# EAGLE design boron-programmer (EAGLE 8.3.2)
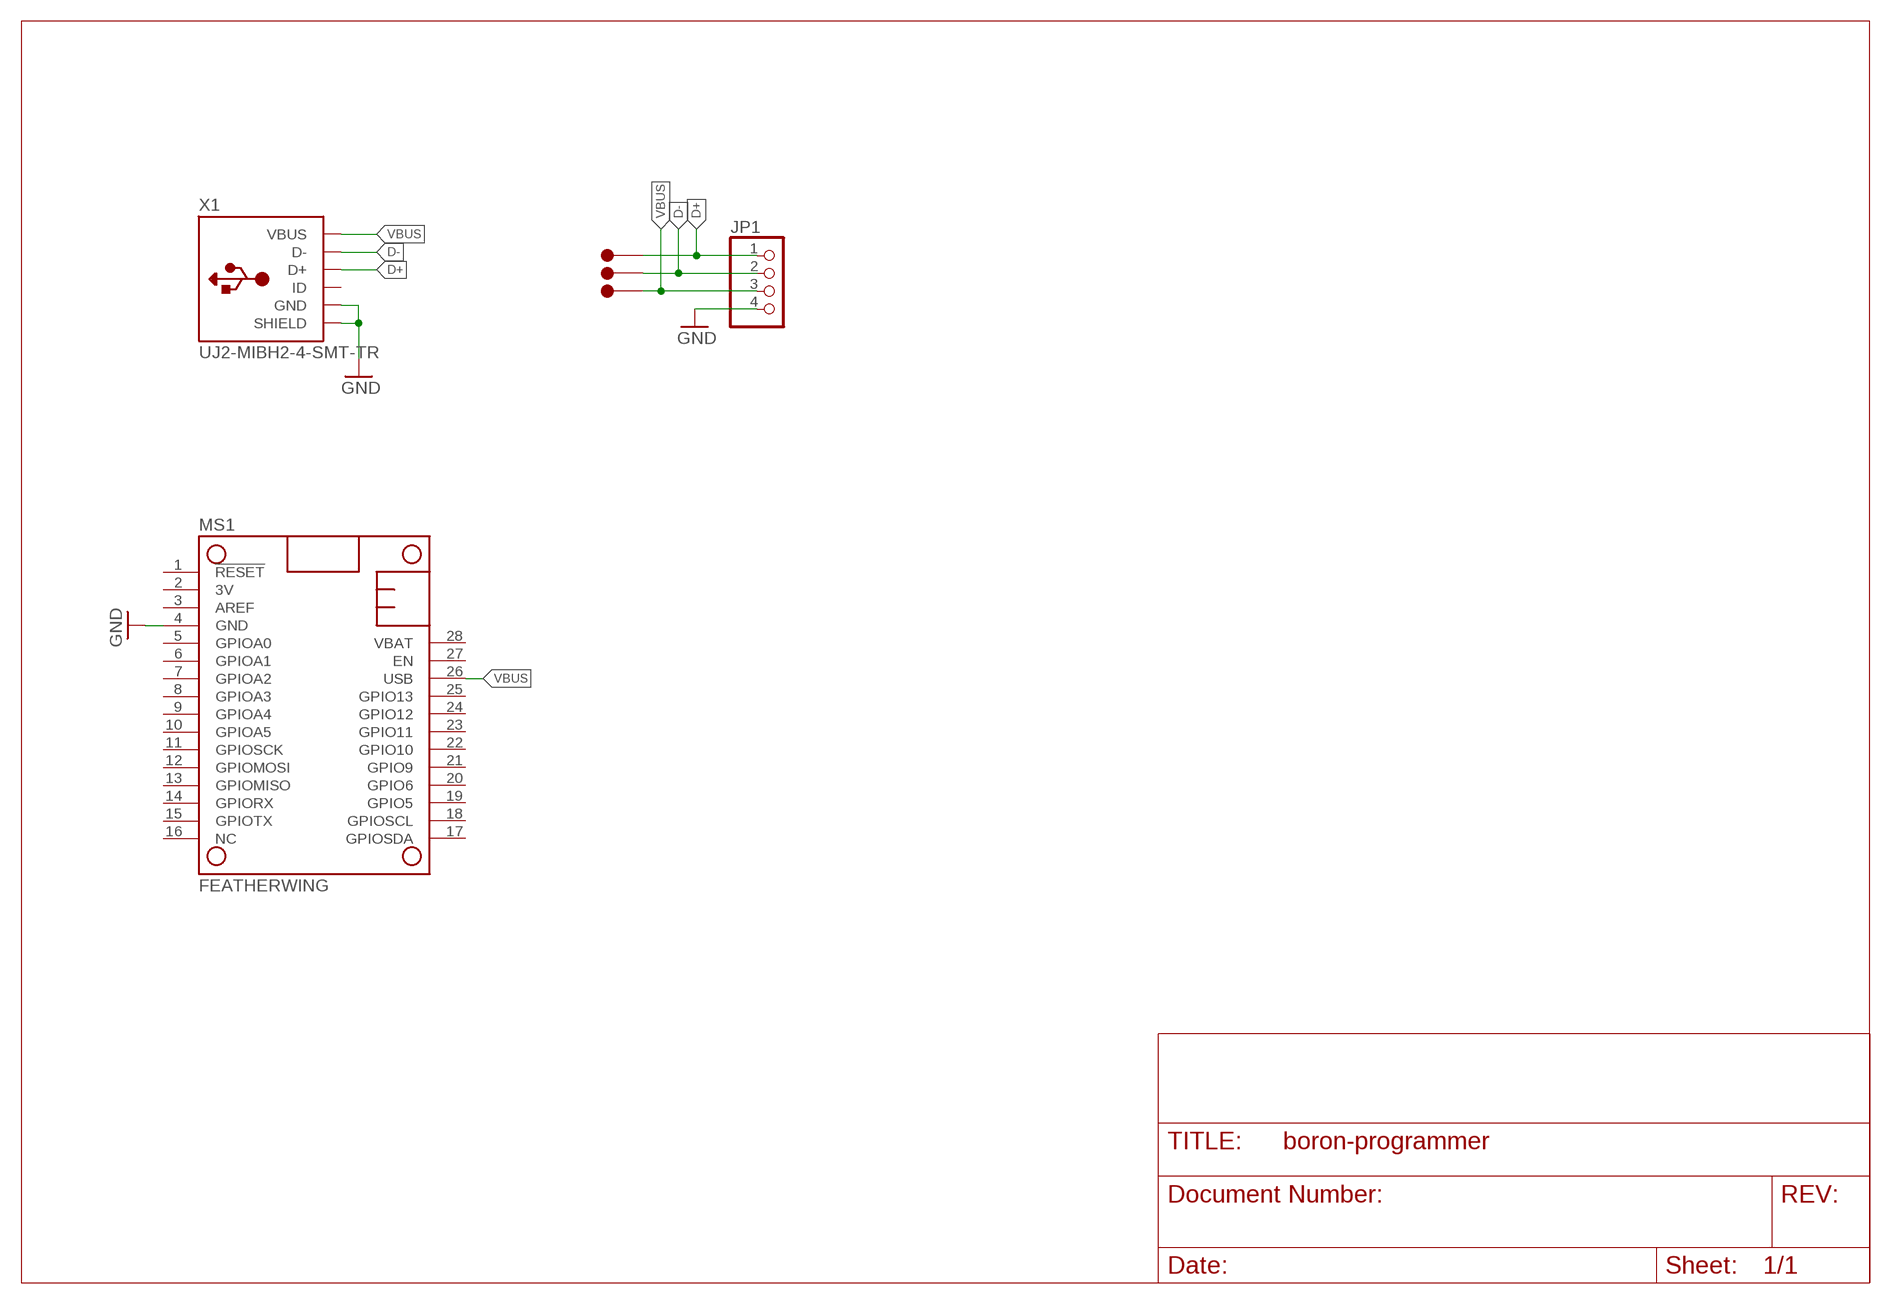
[diagram p0: schematic, sheet 1]

## Parts
C1  POGO_PIN_1MM  [POGO_1MM]
C2  POGO_PIN_1MM  [POGO_1MM]
C4  POGO_PIN_1MM  [POGO_1MM]
JP1  PINHD-1X4  [1X04]
MS1  FEATHERWING  [FEATHERWING]
X1  UJ2-MIBH2-4-SMT-TR  MICRO_USB_B  [MICRO_USB_B]

## Nets
D+: C1.P$1 JP1.1 X1.D+
D-: C2.P$1 JP1.2 X1.D-
GND: JP1.4 MS1.4(GND) X1.GND X1.SHIELD1(SHIELD) X1.SHIELD2(SHIELD) X1.SHIELD3(SHIELD) X1.SHIELD4(SHIELD) X1.SHIELD5(SHIELD)
VBUS: C4.P$1 JP1.3 MS1.26(USB) X1.VBUS
Unconnected: MS1.1(!RESET) MS1.2(3V) MS1.3(AREF) MS1.5(GPIOA0) MS1.6(GPIOA1) MS1.7(GPIOA2) MS1.8(GPIOA3) MS1.9(GPIOA4) MS1.10(GPIOA5) MS1.11(GPIOSCK) MS1.12(GPIOMOSI) MS1.13(GPIOMISO) MS1.14(GPIORX) MS1.15(GPIOTX) MS1.16(NC) MS1.17(GPIOSDA) MS1.18(GPIOSCL) MS1.19(GPIO5) MS1.20(GPIO6) MS1.21(GPIO9) MS1.22(GPIO10) MS1.23(GPIO11) MS1.24(GPIO12) MS1.25(GPIO13) MS1.27(EN) MS1.28(VBAT) X1.ID

## Library data of the parts
C1 C2 C4 = MyDevices:POGO_PIN_1MM
JP1 = pinhead:PINHD-1X4: PIN HEADER
MS1 = microbuilder:FEATHERWING
X1 = MyDevices:MICRO_USB_B: CONN RCPT 5POS MICRO USB R/A Molex : 47346-0001

## Net classes
0 default: width 0.152 mm, clearance 0.152 mm
2 RF: width 0.33 mm, clearance 0.191 mm
3 BAT: clearance 0.203 mm
6 +3V3: width 0.152 mm, clearance 0.152 mm

## Board
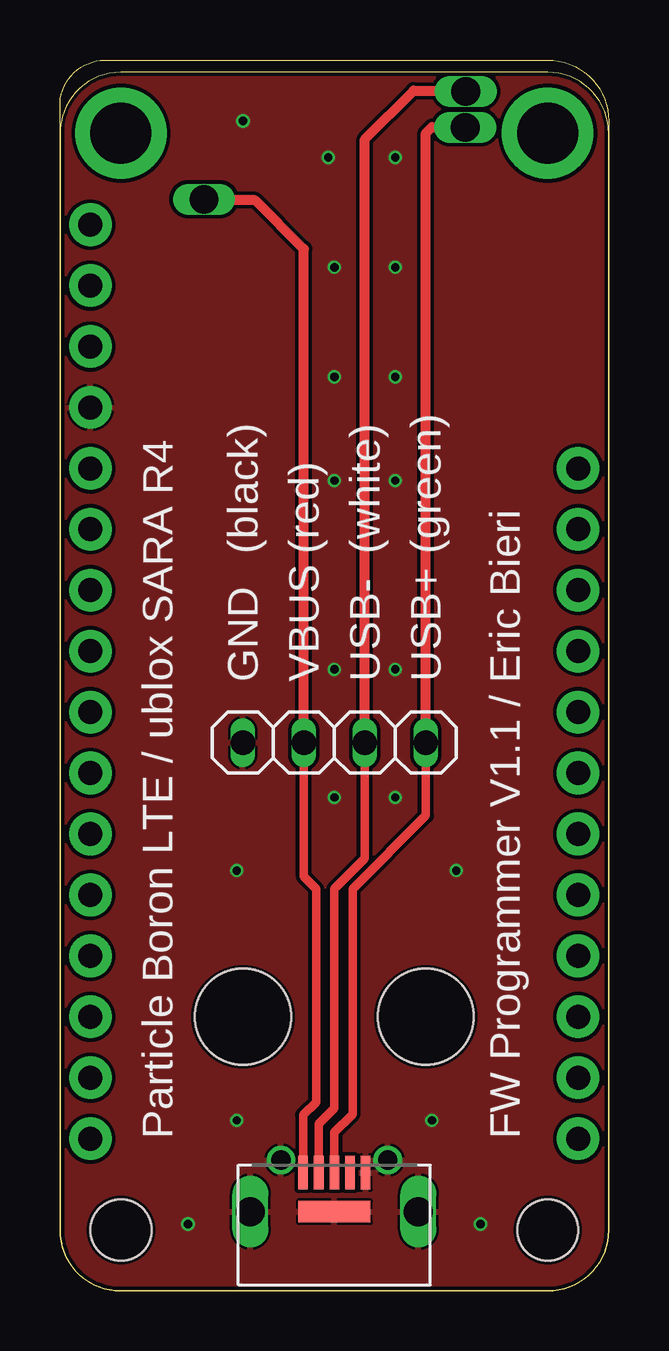
[diagram p1: board, top side]
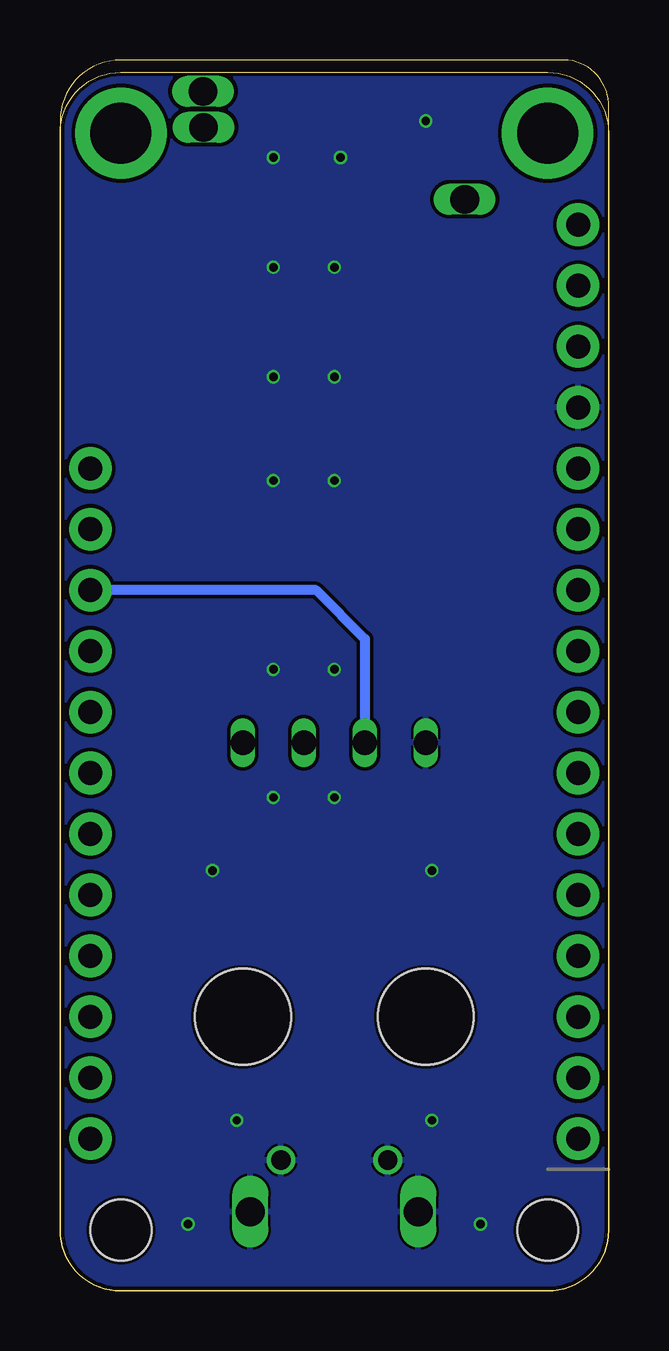
[diagram p2: board, bottom side, seen from below]

Size 22.86 x 51.31 mm. Coordinates in mm from the lower left corner, seen from the top.
Outline: 22.86,48.77 22.86,2.54 arc-90 20.32,0 2.54,0 arc-90 0,2.54 0,49.53 arc-90 2.03,51.31 20.32,51.31 arc-90 22.86,48.77
Copper layers (1*16): Top 0.018mm / dielectric 0.195mm / Bottom 0.018mm
Design rules "spark-4layer *": minimum track width 4mil, minimum drill 0.2mm, track to track 6mil, track to pad 6mil, pad to pad 6mil, via to via 6mil, smd to smd 0mil, copper to edge 6mil, drill to drill 6mil, minimum pad ring 0mil, minimum via ring 4mil, stop-mask expansion 0.01mm, vias tented up to drill 16mil, thermal gap 4mil
Holes 2.54 mm at 20.32,2.54 2.54,2.54
Holes 4 mm at 7.62,11.43 15.24,11.43

### Footprints (pad centres in the part's own frame; a part is rotated, then mirrored left to right if it is on the bottom)
POGO_1MM = drill 1.2 pad 1.3 long: P$1 0,0
1X04 = drill 1.016 long: 1 -3.81,0; 2 -1.27,0; 3 1.27,0; 4 3.81,0
FEATHERWING = drill 1 pad 1.778: 1 6.35,1.27; 2 8.89,1.27; 3 11.43,1.27; 4 13.97,1.27; 5 16.51,1.27; 6 19.05,1.27; 7 21.59,1.27; 8 24.13,1.27; 9 26.67,1.27; 10 29.21,1.27; 11 31.75,1.27; 12 34.29,1.27; 13 36.83,1.27; 14 39.37,1.27; 15 41.91,1.27; 16 44.45,1.27; 17 44.45,21.59; 18 41.91,21.59; 19 39.37,21.59; 20 36.83,21.59; 21 34.29,21.59; 22 31.75,21.59; 23 29.21,21.59; 24 26.67,21.59; 25 24.13,21.59; 26 21.59,21.59; 27 19.05,21.59; 28 16.51,21.59 | drill 2.5 pad 3.81: P$1 2.54,20.32; P$2 2.54,2.54 | hole 2.54: 48.26,20.32; 48.26,2.54
MICRO_USB_B = smd 1.4 x 0.4: D+ 4.675,0; D- 4.675,0.65; GND 4.675,-1.3; ID 4.675,-0.65; VBUS 4.675,1.3 | drill 1.2 pad 1.5 long: SHIELD1 3.05,3.5; SHIELD2 3.05,-3.5 | drill 0.8 pad 1.2: SHIELD3 5.2,2.225; SHIELD4 5.2,-2.225 | smd 0.9 x 3: SHIELD5 3.05,0

### Placement (x,y rotation side)
C1  16.88,48.5 0 top
C2  16.9,50 0 top
C4  6,45.5 0 top
JP1  11.43,22.86 180 top
MS1  0,50.8 270 top
X1  11.43,0.25 90 top

### Tracks (layer width: path | path; a pad name or v marks a point on that pad's centre or on a via)
D+
  Top 0.152: 16.87,48.51 C1.P$1
  Top 0.356: JP1.1 15.24,19.81 12.19,16.76 12.19,7.37 11.43,6.6 X1.D+
  Top 0.406: JP1.1 15.24,48.26 15.49,48.51 16.87,48.51
D-
  Top 0.152: 16.86,50.04 C2.P$1
  Top 0.356: JP1.2 12.7,18.03 11.43,16.76 11.43,7.62 10.78,6.97 X1.D-
  Top 0.406: 16.86,50.04 14.73,50.04 12.7,48.01 JP1.2 12.69,22.85
GND  (via drill 0.35)
  other vias: 13.97,20.57 13.97,25.91 13.97,33.78 13.97,47.24 13.97,42.67 13.97,38.1 11.43,33.78 11.43,38.1 11.43,42.67 11.18,47.24 7.62,48.77 11.43,25.91 7.37,7.11 15.49,7.11 5.33,2.79 17.53,2.79 11.43,20.57 7.37,17.53 16.51,17.53
  pour Top: 0,51.31 22.86,51.31 22.86,0 0,0
  pour Bottom: 0,51.31 22.86,51.31 22.86,0 0,0
N$9  (via drill 2.54)
  other vias: 2.54,48.26
N$10  (via drill 2.54)
  other vias: 20.32,48.26
VBUS
  Top 0.356: 10.13,4.82 10.13,4.81 X1.VBUS 10.13,7.34 10.67,7.87 10.67,16.76 10.16,17.27 JP1.3
  Top 0.406: JP1.3 10.16,43.43 8.13,45.47 6.03,45.47
  Top 0.61: 6.03,45.47 C4.P$1
  Bottom 0.406: MS1.26 12.19,29.21 10.16,27.18 JP1.3

### Text on the board
tPlace: (black) | (red) | (white) | (green) | GND | VBUS | USB- | USB+ | Particle Boron LTE / ublox SARA R4 | FW Programmer V1.1 / Eric Bieri